# EAGLE board AK4493-v1.64_23 (EAGLE 9.6.2)
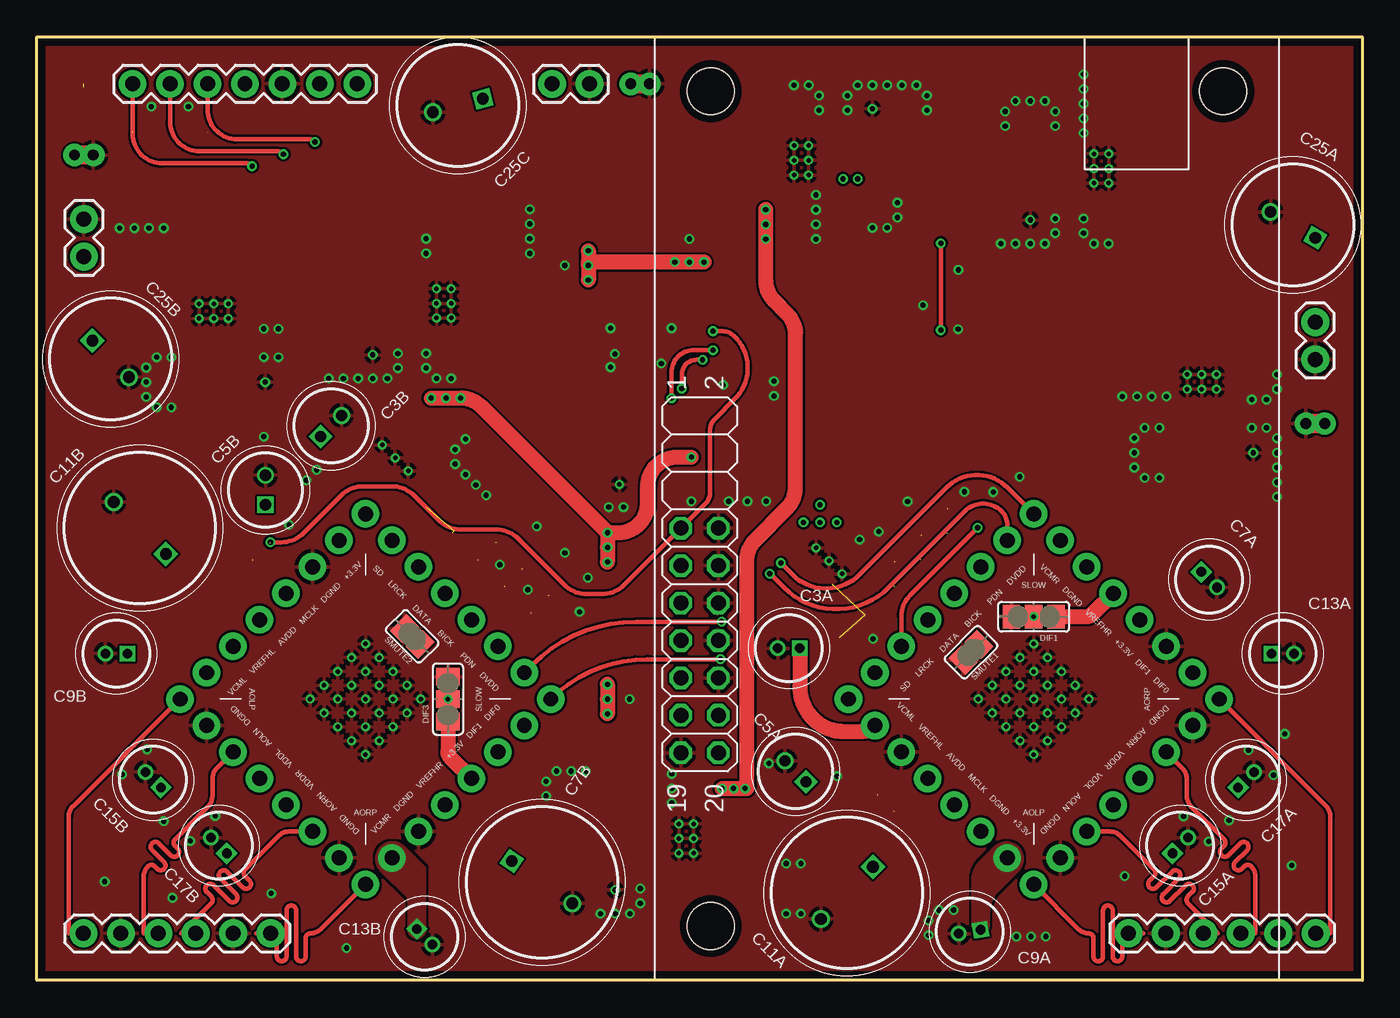
[diagram p2: board, top side]
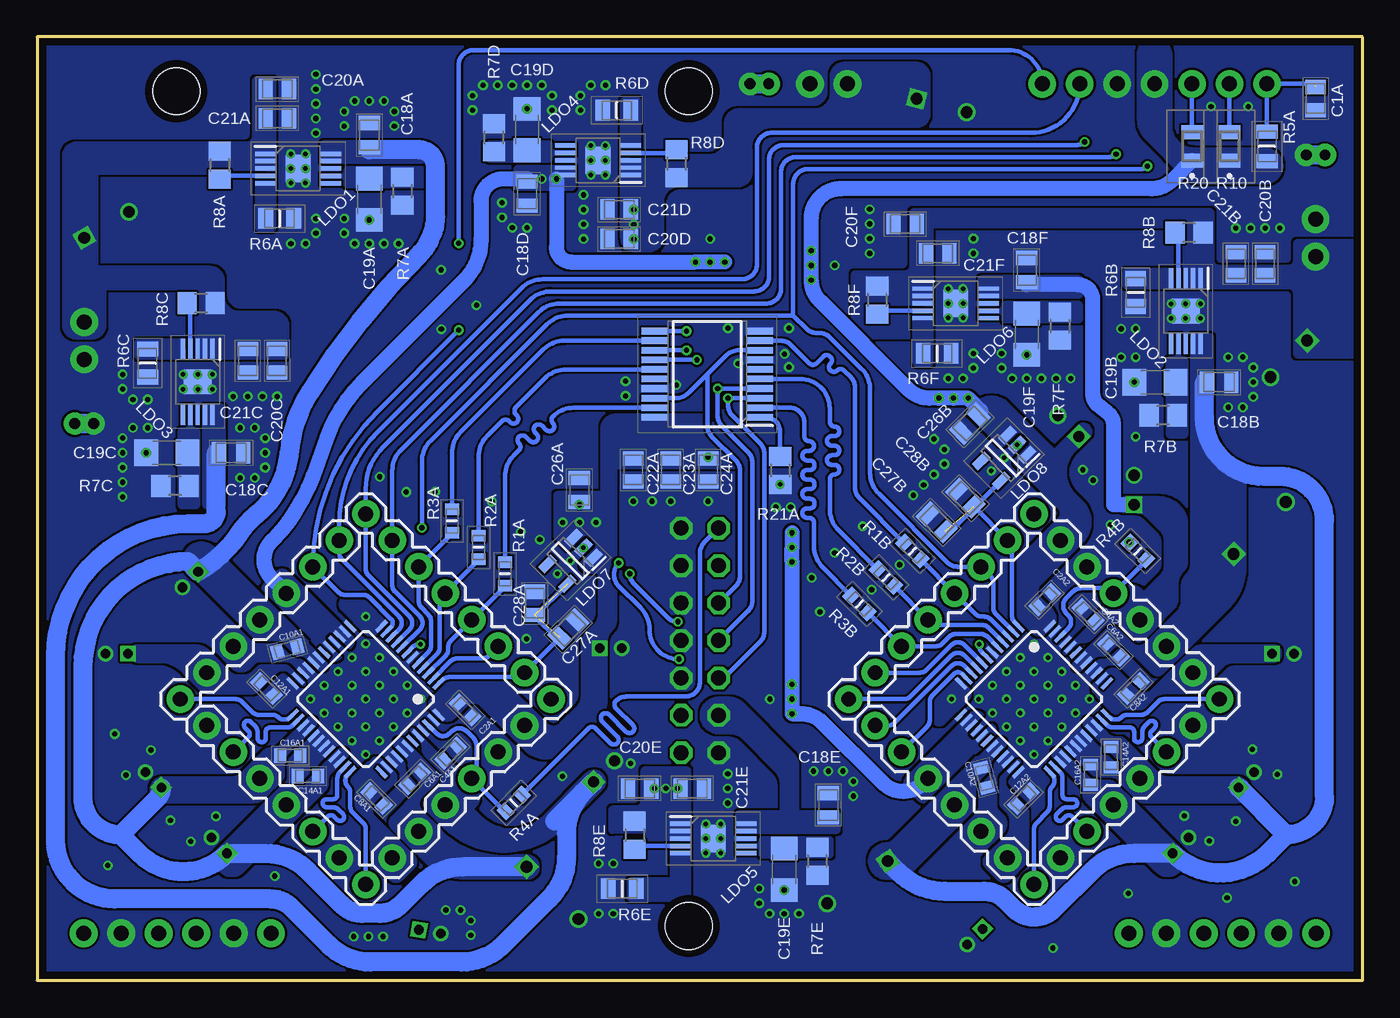
[diagram p3: board, bottom side, seen from below]

Size 89.89 x 64 mm. Coordinates in mm from the lower left corner, seen from the top.
Outline: 0,64 89.89,64 89.89,0 0,0 0,64
Copper layers (1*16): Top 0.035mm / dielectric 1.6mm / Bottom 0.035mm
Design rules "Elecrow_2-layer_PCB_eagle_rule": minimum track width 6mil, minimum drill 12mil, track to track 6mil, track to pad 6mil, pad to pad 6mil, via to via 8mil, smd to smd 0mil, copper to edge 20mil, drill to drill 10mil, minimum pad ring 6mil, minimum via ring 6mil, stop-mask expansion 0mil, vias tented up to drill 100mil, thermal gap 10mil
Net classes: 3 Power: width 1.27 mm, drill 1.27 mm, clearance 0.254 mm

## Footprints (pad centres in the part's own frame; a part is rotated, then mirrored left to right if it is on the bottom)
I2SOVERUSBV3 = drill 1.016 octagon: H3.7 33.322,1.745; H3.8 33.322,4.285; H3.9 35.862,1.745; H3.10 35.862,4.285; H3.11 38.403,1.745; H3.12 38.403,4.285; H3.13 40.943,1.745; H3.14 40.943,4.285; H3.15 43.483,1.745; H3.16 43.483,4.285; H3.17 46.023,1.745; H3.18 46.023,4.285; H3.19 48.562,1.745; H3.20 48.562,4.285 | hole 3.175: 3.688,3.775; 3.688,38.525; 60.312,3.775
CAPC2012X135N = smd 0.96 x 1.39: 1 -0.79,0; 2 0.79,0
CAPC1608X95N = smd 0.81 x 0.99: 1 -0.69,0; 2 0.69,0
CAPPRD150W45D450H600 = drill 0.65 pad 1.05 square: 1 0,0 | drill 0.65 pad 1.05: 2 1.5,0
CAPPRD200W55D500H800 = drill 0.75 pad 1.15 square: 1 0,0 | drill 0.75 pad 1.15: 2 2,0
CAPPRD500W60D1025H2150 = drill 0.8 pad 1.2 square: 1 0,0 | drill 0.8 pad 1.2: 2 5,0
CAPC2013X140N = smd 0.96 x 1.44: 1 -0.82,0; 2 0.82,0
C1206 = smd 1.6 x 1.8: 1 -1.4,0; 2 1.4,0 | drill 0.35: DGND 1.4,0
CAPPRD350W60D825H1300 = drill 0.8 pad 1.2 square: 1 0,0 | drill 0.8 pad 1.2: 2 3.5,0
SJ_2 = smd 1.168 x 1.6: 1 -1.524,0; 2 0,0; 3 1.524,0
LQFP48_ = smd 0.25 x 1: 1 -2.75,-4.25; 2 -2.25,-4.25; 3 -1.75,-4.25; 4 -1.25,-4.25; 5 -0.75,-4.25; 6 -0.25,-4.25; 7 0.25,-4.25; 8 0.75,-4.25; 9 1.25,-4.25; 10 1.75,-4.25; 11 2.25,-4.25; 12 2.75,-4.25; 25 2.75,4.25; 26 2.25,4.25; 27 1.75,4.25; 28 1.25,4.25; 29 0.75,4.25; 30 0.25,4.25; 31 -0.25,4.25; 32 -0.75,4.25; 33 -1.25,4.25; 34 -1.75,4.25; 35 -2.25,4.25; 36 -2.75,4.25 | smd 1 x 0.25: 13 4.25,-2.75; 14 4.25,-2.25; 15 4.25,-1.75; 16 4.25,-1.25; 17 4.25,-0.75; 18 4.25,-0.25; 19 4.25,0.25; 20 4.25,0.75; 21 4.25,1.25; 22 4.25,1.75; 23 4.25,2.25; 24 4.25,2.75; 37 -4.25,2.75; 38 -4.25,2.25; 39 -4.25,1.75; 40 -4.25,1.25; 41 -4.25,0.75; 42 -4.25,0.25; 43 -4.25,-0.25; 44 -4.25,-0.75; 45 -4.25,-1.25; 46 -4.25,-1.75; 47 -4.25,-2.25; 48 -4.25,-2.75 | drill 0.305 pad 0.61: P$1 0,0; P$2 -1.327,0; P$3 -2.655,0; P$4 1.327,0; P$5 2.655,0; P$6 0,1.327; P$7 0,2.655; P$8 0,-1.327; P$9 0,-2.655; P$10 -1.327,-1.327; P$11 -2.655,-1.327; P$12 -2.655,-2.655; P$13 -1.327,-2.655; P$14 1.327,-2.655; P$15 2.655,-2.655; P$16 2.655,-1.327; P$17 1.327,-1.327; P$18 1.327,1.327; P$19 2.655,1.327; P$20 2.655,2.655; P$21 1.327,2.655; P$22 -1.327,2.655; P$23 -2.655,2.655; P$24 -2.655,1.327; P$25 -1.327,1.327
SOP65P780X200-20N = smd 1.8 x 0.45: 1 -3.55,2.925; 2 -3.55,2.275; 3 -3.55,1.625; 4 -3.55,0.975; 5 -3.55,0.325; 6 -3.55,-0.325; 7 -3.55,-0.975; 8 -3.55,-1.625; 9 -3.55,-2.275; 10 -3.55,-2.925; 11 3.55,-2.925; 12 3.55,-2.275; 13 3.55,-1.625; 14 3.55,-0.975; 15 3.55,-0.325; 16 3.55,0.325; 17 3.55,0.975; 18 3.55,1.625; 19 3.55,2.275; 20 3.55,2.925
1X02 = drill 1.016 pad 1.88: 1 0,0; 2 2.54,0
1X07 = drill 1.016 pad 1.88: 1 0,0; 2 2.54,0; 3 5.08,0; 4 7.62,0; 5 10.16,0; 6 12.7,0; 7 15.24,0
1X06 = drill 1.016 pad 1.88: 1 0,0; 2 2.54,0; 3 5.08,0; 4 7.62,0; 5 10.16,0; 6 12.7,0
SOP50P490X110-11N = smd 1.425 x 0.3: 1 -2.212,1; 2 -2.212,0.5; 3 -2.212,0; 4 -2.212,-0.5; 5 -2.212,-1; 6 2.212,-1; 7 2.212,-0.5; 8 2.212,0; 9 2.212,0.5; 10 2.212,1 | smd 1.68 x 1.88: 11 0,0 | drill 0.305 pad 0.61: P$1 -0.498,0; P$2 0.498,0; P$3 -0.498,0.995; P$4 0.498,0.995; P$5 -0.498,-0.995; P$6 0.498,-0.995
SOT95P280X145-5N = smd 1.2 x 0.6: 1 -1.25,0.95; 2 -1.25,0; 3 -1.25,-0.95; 4 1.25,-0.95; 5 1.25,0.95 | drill 0.305 pad 0.61: DGND -1.25,0; DGND2 0,0; DGND3 1.25,0
RESC1608X55N = smd 0.8 x 0.95: 1 -0.8,0; 2 0.8,0
RESC2012X50N = smd 0.95 x 1.45: 1 -1,0; 2 1,0
RESC2012X60N = smd 1 x 1.4: 1 -0.95,0; 2 0.95,0
R0805 = smd 1.3 x 1.5: 1 -0.95,0; 2 0.95,0
RCS0805_E3 = smd 0.95 x 1.45: 1 -0.975,0; 2 0.975,0
R0805-POL = smd 1.3 x 1.5: 1 -0.95,0; 2 0.95,0 | drill 0.305 pad 0.61: DGND 0.95,0
SHORT_ALL-50 = drill 0.737 pad 1.524: 1 -0.635,0; 2 0.635,0
SJ = smd 1.168 x 1.6: 1 -0.762,0; 2 0.762,0

## Placement (x,y rotation side)
BD1  I2SOVERUSBV3  [I2SOVERUSBV3]  41.93,64 270 top
C1A  0.1uF, X7R  [CAPC2012X135N]  3.19,59.81 270 bottom
C2A1  0.1u, Ceramic Capacitor X7R  [CAPC1608X95N]  60.87,18.35 315 bottom
C2A2  0.1u, Ceramic Capacitor X7R  [CAPC1608X95N]  21.55,25.82 45 bottom
C3A  80-A758BG106M1EAAE70  [CAPPRD150W45D450H600]  51.75,22.53 180 top
C3B  80-A758BG106M1EAAE70  [CAPPRD200W55D500H800]  19.25,36.9 45 top
C4A1  0.1u, Ceramic Capacitor X7R  [CAPC1608X95N]  61.86,15.42 45 bottom
C4A2  0.1u, Ceramic Capacitor X7R  [CAPC1608X95N]  18.62,24.83 135 bottom
C5A  80-A758BG106M1EAAE70  [CAPPRD200W55D500H800]  52.15,13.47 135 top
C5B  80-A758BG106M1EAAE70  [CAPPRD200W55D500H800]  15.5,32.26 90 top
C6A1  0.1u, Ceramic Capacitor X7R  [CAPC1608X95N]  64.3,13.68 225 bottom
C6A2  0.1u, Ceramic Capacitor X7R  [CAPC1608X95N]  16.88,22.39 315 bottom
C7A  RNU1A100MDSASQ  [CAPPRD150W45D450H600]  78.97,27.72 315 top
C7B  APSG160ELL222MJ20S  [CAPPRD500W60D1025H2150]  32.22,8.09 325 top
C8A1  0.1u, Ceramic Capacitor X7R  [CAPC1608X95N]  66.88,12.34 315 bottom
C8A2  0.1u, Ceramic Capacitor X7R  [CAPC1608X95N]  15.54,19.81 45 bottom
C9A  647-RNU1A100MDSASQ  [CAPPRD150W45D450H600]  64,3.44 190 top
C9B  647-RNU1A100MDSASQ  [CAPPRD150W45D450H600]  6.14,22.17 180 top
C10A1  0.1u, Ceramic Capacitor X7R  [CAPC1608X95N]  72.93,22.46 195 bottom
C10A2  0.1u, Ceramic Capacitor X7R  [CAPC1608X95N]  25.66,13.75 285 bottom
C11A  APSG160ELL222MJ20S  [CAPPRD500W60D1025H2150]  56.71,7.7 225 top
C11B  2200uF, 10V  [CAPPRD500W60D1025H2150]  8.75,28.92 135 top
C12A1  0.1u, Ceramic Capacitor X7R  [CAPC1608X95N]  74.34,19.8 315 bottom
C12A2  0.1u, Ceramic Capacitor X7R  [CAPC1608X95N]  23.01,12.34 45 bottom
C13A  647-RNU1A100MDSASQ  [CAPPRD150W45D450H600]  83.75,22.17 0 top
C13B  647-RNU1A100MDSASQ  [CAPPRD150W45D450H600]  25.77,3.49 315 top
C14A1  0.1u, Ceramic Capacitor X7R  [CAPC1608X95N]  71.53,13.86 180 bottom
C14A2  0.1u, Ceramic Capacitor X7R  [CAPC1608X95N]  17.06,15.15 270 bottom
C15A  647-RNU1A100MDSASQ  [CAPPRD150W45D450H600]  77.01,8.62 45 top
C15B  647-RNU1A100MDSASQ  [CAPPRD150W45D450H600]  8.41,13.08 135 top
C16A1  0.1u, Ceramic Capacitor X7R  [CAPC1608X95N]  72.74,15.24 0 bottom
C16A2  0.1u, Ceramic Capacitor X7R  [CAPC1608X95N]  18.45,13.95 90 bottom
C17A  647-RNU1A100MDSASQ  [CAPPRD150W45D450H600]  81.48,13.08 45 top
C17B  647-RNU1A100MDSASQ  [CAPPRD150W45D450H600]  12.88,8.62 135 top
C18A  4.7u  [CAPC2013X140N]  67.37,57.34 90 bottom
C18B  4.7u  [CAPC2013X140N]  9.73,40.58 0 bottom
C18C  4.7u  [CAPC2013X140N]  76.74,35.78 0 bottom
C18D  4.7u  [CAPC2013X140N]  56.67,53.36 270 bottom
C18E  4.7u  [CAPC2013X140N]  36.24,11.89 90 bottom
C18F  4.7u  [CAPC2013X140N]  22.78,48.19 90 bottom
C19A  22u  [C1206]  67.37,52.98 270 bottom
C19B  22u  [C1206]  14.08,40.58 180 bottom
C19C  22u  [C1206]  81.1,35.78 180 bottom
C19D  22u  [C1206]  56.67,57.72 90 bottom
C19E  22u  [C1206]  39.22,7.53 270 bottom
C19F  22u  [C1206]  22.78,43.83 270 bottom
C20A  10u  [CAPC2012X135N]  73.61,60.46 0 bottom
C20B  10u  [CAPC2012X135N]  6.61,48.61 90 bottom
C20C  10u  [CAPC2012X135N]  73.62,42.03 270 bottom
C20D  10u  [CAPC2012X135N]  50.43,50.29 180 bottom
C20E  10u  [CAPC2012X135N]  49.03,13.02 180 bottom
C20F  10u  [CAPC2012X135N]  31.02,51.31 180 bottom
C21A  0.1u  [CAPC2012X135N]  73.61,58.47 0 bottom
C21B  0.1u  [CAPC2012X135N]  8.6,48.61 90 bottom
C21C  0.1u  [CAPC2012X135N]  75.61,42.03 270 bottom
C21D  0.1u  [CAPC2012X135N]  50.43,52.28 180 bottom
C21E  0.1u  [CAPC2012X135N]  45.47,13.02 0 bottom
C21F  0.1u  [CAPC2012X135N]  28.81,49.32 0 bottom
C22A  0.1u, Ceramic Capacitor X7R  [CAPC2012X135N]  49.47,34.62 270 bottom
C23A  0.1u, Ceramic Capacitor X7R  [CAPC2012X135N]  46.93,34.62 270 bottom
C24A  0.1u, Ceramic Capacitor X7R  [CAPC2012X135N]  44.39,34.62 270 bottom
C25A  470u  [CAPPRD350W60D825H1300]  86.7,50.37 150 top
C25B  470u  [CAPPRD350W60D825H1300]  3.77,43.39 315 top
C25C  470u  [CAPPRD350W60D825H1300]  30.24,59.8 195 top
C26A  4.7u, Ceramic Capacitor X7R  [CAPC2013X140N]  53.12,33.27 90 bottom
C26B  4.7u, Ceramic Capacitor X7R  [CAPC2013X140N]  26.62,37.76 225 bottom
C27A  4.7u, Ceramic Capacitor X7R  [CAPC2013X140N]  53.87,23.84 45 bottom
C27B  4.7u, Ceramic Capacitor X7R  [CAPC2013X140N]  28.89,31.07 135 bottom
C28A  0.1u, Ceramic Capacitor X7R  [CAPC2012X135N]  56.14,25.57 90 bottom
C28B  0.1u, Ceramic Capacitor X7R  [CAPC2012X135N]  26.93,32.71 135 bottom
DIF1  [SJ_2]  67.61,24.67 0 top
DIF3  [SJ_2]  27.88,19.08 270 top
IC2  AK4493  [LQFP48_]  67.61,19.08 135 bottom
IC3  AK4493  [LQFP48_]  22.28,19.08 225 bottom
IC4A  SN74ABT273DBR  [SOP65P780X200-20N]  44.44,41.12 180 bottom
J1  [1X02]  3.19,49.1 90 top
J2  [1X02]  34.94,60.81 0 top
J3  [1X07]  6.49,60.81 0 top
J4  [1X06]  74.03,3.19 0 top
J5  [1X07]  80.18,19.08 45 bottom
J6  [1X07]  67.61,6.51 135 bottom
J7  [1X07]  55.03,19.08 225 bottom
J8  [1X07]  67.61,31.65 315 bottom
J9  [1X07]  22.28,6.51 135 bottom
J10  [1X07]  9.71,19.08 225 bottom
J11  [1X07]  22.28,31.65 315 bottom
J12  [1X07]  34.85,19.08 45 bottom
J13  [1X06]  3.16,3.19 0 top
J14  [1X02]  86.7,44.66 270 top
LDO1  LT3042  [SOP50P490X110-11N]  72.19,55.07 0 bottom
LDO2  LT3042  [SOP50P490X110-11N]  11.99,45.4 270 bottom
LDO3  LT3042  [SOP50P490X110-11N]  79.01,40.6 270 bottom
LDO4  LT3042  [SOP50P490X110-11N]  51.85,55.63 180 bottom
LDO5  LT3042  [SOP50P490X110-11N]  44.04,9.62 0 bottom
LDO6  LT3042  [SOP50P490X110-11N]  27.6,45.92 0 bottom
LDO7  LP5907-1.8V  [SOT95P280X145-5N]  53.72,28.46 225 bottom
LDO8  LP5907-1.8V  [SOT95P280X145-5N]  24.31,35.44 225 bottom
R1A  RT0603DRE075R1L  [RESC1608X55N]  58.17,27.57 270 bottom
R1B  RT0603DRE075R1L  [RESC1608X55N]  30.53,29.12 315 bottom
R2A  RT0603DRE075R1L  [RESC1608X55N]  59.96,29.37 270 bottom
R2B  RT0603DRE075R1L  [RESC1608X55N]  32.32,27.32 315 bottom
R3A  RT0603DRE075R1L  [RESC1608X55N]  61.76,31.16 270 bottom
R3B  RT0603DRE075R1L  [RESC1608X55N]  34.12,25.53 315 bottom
R4A  RT0603DRE075R1L  [RESC1608X55N]  57.57,12.04 225 bottom
R4B  RT0603DRE075R1L  [RESC1608X55N]  15.24,29.12 315 bottom
R5A  10K, Resistor 1%  [RESC2012X50N]  6.49,56.57 270 bottom
R6A  1k  [RESC2012X60N]  73.45,51.68 0 bottom
R6B  1k  [RESC2012X60N]  15.39,46.66 270 bottom
R6C  1k  [RESC2012X60N]  82.4,41.87 270 bottom
R6D  1k  [RESC2012X60N]  50.59,59.02 180 bottom
R6E  1k  [RESC2012X60N]  50.21,6.23 180 bottom
R6F  1k  [RESC2012X60N]  28.86,42.53 0 bottom
R7A  33k  [R0805]  65.13,53.53 270 bottom
R7B  33k  [R0805]  13.53,38.33 180 bottom
R7C  33k  [R0805]  80.55,33.54 180 bottom
R7D  33k  [R0805]  58.91,57.17 90 bottom
R7E  33k  [R0805]  36.98,8.08 270 bottom
R7F  33k  [R0805]  20.54,44.38 270 bottom
R8A  200k  [R0805]  77.51,55.3 270 bottom
R8B  200k  [R0805]  11.77,50.72 180 bottom
R8C  200k  [R0805]  78.78,45.93 180 bottom
R8D  200k  [R0805]  46.52,55.4 90 bottom
R8E  200k  [R0805]  49.37,9.85 270 bottom
R8F  200k  [R0805]  32.92,46.15 270 bottom
R10  2.2k, 1%  [RCS0805_E3]  9.03,56.57 90 bottom
R20  2.2k, 1%  [RCS0805_E3]  11.57,56.57 90 bottom
R21A  Not Pop.  [R0805-POL]  39.5,34.59 270 bottom
SH1  SHORTA5  [SHORT_ALL-50]  3.19,55.99 180 top
SH2  SHORTA5  [SHORT_ALL-50]  40.91,60.81 180 top
SH3  SHORTA5  [SHORT_ALL-50]  86.7,37.77 0 top
SMUTE1  [SJ]  63.35,22.26 225 top
SMUTE2  [SJ]  25.46,23.33 135 top

## Tracks (layer width: path | path; a pad name or v marks a point on that pad's centre or on a via)
+3V3  (via drill 0.35)
  Top 1.016: 71.58,24.85 arc-45 71.15,24.67 DIF1.3 | 28.05,15.1 arc-45 27.88,15.53 DIF3.3 | J7.2 arc-45 55.86,16.88 54.75,16.88 arc-90 51.75,19.88 C3A.1 | v38.7,28.38 v38.7,29.37 v38.7,30.37 | v38.7,20.08 v38.7,19.08 v38.7,18.09 | v38.7,30.37 30.15,38.91 arc45 v28.74,39.5 v27.74,39.5 v26.75,39.5 | v37.4,49.5 v37.4,48.5 | v37.4,48.5 v37.4,47.51 | v45.25,48.73 v44.25,48.73 v43.26,48.73 37.4,48.73 v37.4,48.5 | v44.39,35.49 43.43,35.49 arc90 41.43,33.49 41.43,32.37 arc-90 39.43,30.37 v38.7,30.37
  Top 1.06: J5.5 71.58,24.85 | J9.5 28.05,15.1
  Bottom 1.016: v54.68,54.36 54.68,49.73 arc-90 53.68,48.73 v45.25,48.73 v44.25,48.73 v43.26,48.73 | J5.5 73.99,27.26 arc90 73.99,29.81 arc-25 71.19,34.22 70.26,36.8 arc25 67.92,40.48 60.97,47.43 arc-45 59.8,50.26 59.8,52.86 arc90 58.3,54.36 56.67,54.36 | 11.57,55.62 12.9,54.29 arc45 14.32,53.7 35.4,53.7 arc-90 37.4,51.7 v37.4,49.5 v37.4,48.5 v37.4,47.51 arc-45 36.81,46.09 30.81,40.09 arc-45 29.39,39.5 v28.74,39.5 v27.74,39.5 v26.75,39.5 25.92,38.67 25.92,38.47 | J9.5 29.74,13.42 arc90 32.57,13.42 36.65,17.5 arc-45 38.07,18.09 v38.7,18.09 v38.7,19.08 v38.7,20.08 v38.7,28.38 v38.7,29.37 v38.7,30.37
  other vias: 55.67,54.36 54.25,31.07 53.12,32.27 53.12,31.07 51.99,31.07
  pour Bottom (no thermals): 57.59,53.89 57.59,54.98 arc90 57.27,55.31 53.67,55.31 arc90 53.35,54.98 53.35,53.89 arc90 53.67,53.56 57.27,53.56 arc90
  pour Bottom (no thermals): 5.39,55.24 arc90 6.64,53.99 10.87,53.99 arc45 12.28,54.58 14.72,57.02 arc45 15.3,58.43 15.3,62.86 arc90 14.17,64 arc90 12.92,62.75 12.92,57.99 arc-90 11.42,56.49 6.64,56.49 arc90
  pour Bottom (no thermals): 21.82,26.84 18.97,29.68 arc-90 18.97,30.54 19.8,31.37 arc-90 20.66,31.37 23.6,28.43 arc-45 23.82,27.88 23.82,25.22 arc-45 23.64,24.79 22.36,23.51 arc-90 21.5,23.51 20.99,24.01 arc-90 20.99,25.15 21.82,25.97 arc90
  pour Bottom (no thermals): 56.14,15.77 55.32,16.59 arc-90 55.32,17.46 58.25,20.39 arc-45 58.8,20.62 61.46,20.62 arc-45 61.89,20.44 63.18,19.16 arc-90 63.18,18.29 62.67,17.78 arc-90 61.54,17.78 60.71,18.61 arc90 59.85,18.61 57,15.77 arc-90
  pour Bottom (rank 2, no thermals): 29.29,12.18 24.99,16.48 arc-90 24.99,17.34 25.79,18.14 arc-90 26.65,18.14 30.95,13.84 arc-90 30.95,12.97 30.15,12.18 arc-90
  pour Bottom (rank 2, no thermals): 74.51,26.09 70.21,21.79 arc-90 69.35,21.79 68.55,22.58 arc-90 68.55,23.45 72.85,27.75 arc-90 73.71,27.75 74.51,26.95 arc-90
  pour Bottom (no thermals): 42.34,35.02 42.34,35.84 arc-45 42.44,36.07 44.72,38.35 arc-45 44.95,38.44 50.57,38.44 50.57,34.7 42.67,34.7 arc-90
  pour Bottom (no thermals): 53,27.94 52.77,27.71 arc-45 52.54,27.61 51.67,27.61 arc-90 51.35,27.94 51.35,32.87 arc-90 51.67,33.19 54.56,33.19 arc-90 54.89,32.87 54.89,30.19 arc-45 54.79,29.96 54.01,29.18 arc-90 53.78,29.18 52.89,30.07 arc90 52.43,30.07 52.11,29.75 arc90 52.11,29.29 53,28.4 arc-90
  pour Bottom (no thermals): 23.59,34.92 23.48,34.82 arc-90 23.02,34.82 21.58,36.27 arc-90 21.58,36.73 24.05,39.2 arc-90 26.31,39.2 26.74,38.77 arc-90 26.74,38.31 24.71,36.28 arc-90 24.25,36.28 23.48,37.05 arc90 23.02,37.05 22.7,36.73 arc90 22.7,36.27 23.59,35.38 arc-90
  pour Bottom (no thermals): 20.91,36.06 19.28,37.69 arc45 18.96,37.83 arc90 18.33,37.2 arc45 18.47,36.88 19.48,35.87 arc-90 19.48,33.04 18.97,32.53 arc90 18.97,29.68 20.66,31.37 arc-90 20.66,32 23.48,34.82 21.58,36.73
  pour Bottom (no thermals): 50.57,38.44 50.57,27.61 51.67,27.61 51.67,37.44 arc90 50.67,38.44
  pour Bottom (no thermals): 50.57,27.61 50.57,24.44 arc45 50.86,23.73 50.92,23.68 arc-45 51.22,22.97 51.22,21.66 arc90 52.21,20.66 arc90 53.02,21.46 53.02,22.88 arc45 52.72,23.58 52.14,24.16 arc-45 51.85,24.87 51.85,27.61
  pour Bottom (no thermals): 51.22,21.66 51.22,19.05 arc47 51.84,17.6 54.03,15.54 arc88 56.81,15.58 57,15.77 55.32,17.46 arc-90 54.45,17.46 53.31,18.6 arc-45 53.02,19.31 53.02,21.66
+5V/1
  Bottom 1.272: 67.37,56.34 63.99,56.34 arc90 62.89,55.24 62.89,51.96 arc45 64.06,49.13 arc-13 71.41,39.89 arc-26 72.81,35.75 arc45 75.04,31.57 arc-17 76.2,30.3 arc26 C7A.1 79.66,28.4 arc-90 86.8,21.26 86.8,12.46 arc-90 84.22,9.88 | 81.48,13.04 arc45 81.77,12.33 84.22,9.88 | 84.22,9.88 82.96,8.62 arc-90 C15A.1 | C15A.1 | C15A.1 74.38,8.62 arc45 71.55,7.45 69.24,5.14 arc-45 67.82,4.55 66.65,4.55 arc-45 65.23,5.14 63.84,6.53 arc45 61.01,7.7 C11A.1
  pour Bottom (no thermals): 63.87,55.39 70.36,55.39 arc90 70.69,55.72 70.69,56.66 arc90 70.36,56.98 63.87,56.98 arc90 63.55,56.66 63.55,55.72 arc90
  pour Bottom (no thermals): 63.77,11.54 62.5,10.27 arc90 62.5,9.41 63.33,8.58 arc90 64.19,8.58 65.87,10.26 arc90 65.87,11.12 64.18,12.81 arc-90 64.18,13.67 64.54,14.03 arc45 64.72,14.46 64.72,14.63 arc-45 64.9,15.06 65.6,15.77 arc180 65.01,16.37 62.84,14.2 arc90 62.84,13.34 63.77,12.4 arc-90
  pour Bottom (no thermals): 70.32,21.68 71.41,22.77 arc45 71.48,22.95 arc-45 71.54,23.09 74.52,26.07 arc-90 75.39,26.07 76.3,25.15 arc-90 76.3,24.29 75.22,23.21 arc-45 74.79,23.03 73.65,23.03 arc45 73.22,22.85 72.53,22.16 arc-45 72.1,21.98 72.07,21.98 arc45 71.64,21.81 70.91,21.08 arc-180
  pour Bottom (no thermals): 68.9,15.06 arc-180 69.5,15.66 71.75,13.41 arc45 72.18,13.23 73.09,13.23 arc-45 73.52,13.05 74.51,12.07 arc-90 74.51,11.21 73.68,10.38 arc-90 72.82,10.38 70.3,12.9 arc-45 70.12,13.33 70.12,13.59 arc45 69.95,14.02
  pour Bottom (no thermals): 71.62,17.78 arc180 71.02,17.18 72.91,15.29 arc-45 73.09,14.86 73.09,13.95 arc45 73.27,13.52 73.79,13 arc90 76.3,13 arc90 76.3,13.86 74.56,15.61 arc45 74.13,15.79 73.87,15.79 arc-45 73.44,15.97
  pour Bottom (no thermals): 76.3,24.29 79.64,27.62 arc90 79.64,29.41 arc90 77.86,29.41 74.52,26.07
  pour Bottom (rank 2, no thermals): 62.5,10.27 arc-45 58,8.54 56.66,8.54 arc90 55.81,7.69 arc90 56.66,6.84 60.93,6.84 arc45 63.52,7.91 64.19,8.58
  pour Bottom (no thermals): 72.82,10.38 75.84,7.36 arc90 77.53,7.36 77.74,7.57 arc90 77.74,8.84 74.51,12.07
  pour Bottom (no thermals): 74.12,14.36 arc90 74.12,12.66 74.47,12.32 arc45 75.18,12.03 81.36,12.03 arc90 82.27,12.93 arc90 81.36,13.83 76.76,13.83 arc-45 76.05,14.12 75.81,14.35 arc90
+5V/2
  Bottom 1.272: 5.17,9.88 arc-90 2.59,12.46 2.59,31.19 arc-90 5.59,34.19 6.73,34.19 arc90 10.73,38.19 10.73,40.58 | C7B.1 31.47,7.34 arc-45 28.35,6.05 25.67,6.05 arc45 24.25,5.46 23.67,4.89 arc-45 22.26,4.3 arc-45 20.94,4.85 18.34,7.45 arc45 15.51,8.62 C17B.1 arc-90 6.43,8.62 5.17,9.88 | C15B.1 5.21,9.88 5.17,9.88
  pour Bottom (no thermals): 11.68,37.08 11.68,43.57 arc90 11.35,43.9 10.41,43.9 arc90 10.08,43.57 10.08,37.08 arc90 10.41,36.75 11.35,36.75 arc90
  pour Bottom (no thermals): 24.88,16.37 25.98,15.28 arc45 26.15,15.2 arc-45 26.29,15.14 29.28,12.16 arc-90 29.28,11.3 28.36,10.38 arc-90 27.5,10.38 26.41,11.46 arc-45 26.24,11.89 26.24,13.04 arc45 26.06,13.47 25.37,14.16 arc-45 25.19,14.59 25.19,14.61 arc45 25.01,15.04 24.28,15.77 arc-180
  pour Bottom (no thermals): 14.75,22.91 13.48,24.18 arc90 12.61,24.18 11.79,23.36 arc90 11.79,22.5 13.47,20.82 arc90 14.33,20.82 16.01,22.5 arc-90 16.88,22.5 17.23,22.14 arc45 17.67,21.97 17.84,21.97 arc-45 18.27,21.79 18.97,21.08 arc180 19.57,21.68 17.4,23.85 arc90 16.54,23.85 15.61,22.91 arc-90
  pour Bottom (no thermals): 20.99,15.06 arc180 20.39,15.66 18.5,13.77 arc-45 18.06,13.59 17.16,13.59 arc45 16.72,13.41 15.38,12.07 arc90 15.38,11.21 16.21,10.38 arc90 17.07,10.38 18.82,12.13 arc45 18.99,12.56 18.99,12.82 arc-45 19.17,13.25
  pour Bottom (no thermals): 18.27,17.78 arc-180 18.87,17.18 16.61,14.93 arc45 16.43,14.5 16.43,13.59 arc-45 16.26,13.16 15.27,12.18 arc-90 14.41,12.18 13.58,13 arc-90 13.58,13.86 16.1,16.38 arc-45 16.53,16.56 16.79,16.56 arc45 17.22,16.74
  pour Bottom (no thermals): 7.88,34.19 7.88,28.06 arc45 9.06,25.23 11.79,22.5 13.48,24.18 12.62,25.04 arc-45 12.33,25.74 12.33,26.71 arc45 11.96,27.61 arc-45 11.68,28.29 11.68,37.08 10.73,37.08 10.73,37.03 arc-90
  pour Bottom (no thermals): 27.5,10.38 30.47,7.41 arc45 31.88,6.82 32.27,6.82 arc90 33.54,8.09 arc90 32.27,9.37 arc-45 31.92,9.51 29.27,12.16
  pour Bottom (no thermals): 15.76,14.36 arc-90 14.07,14.35 arc-90
  pour Bottom (no thermals): 15.76,14.36 arc-90 15.77,12.66 15.42,12.32 arc-45 14.71,12.03 8.52,12.03 arc-90 7.62,12.93 arc-90 8.52,13.83 13.13,13.83 arc45 13.84,14.12 14.07,14.35 arc-90
  pour Bottom (no thermals): 17.07,10.38 14.05,7.36 arc-90 12.36,7.36 12.15,7.57 arc-90 12.15,8.84 15.38,12.07
+5V/3
  pour Bottom (no thermals): 35.73,9.94 42.22,9.94 arc90 42.54,10.27 42.54,11.21 arc90 42.22,11.53 35.73,11.53 arc90 35.4,11.21 35.4,10.27 arc90
  pour Bottom (no thermals): 38.22,11.53 38.22,14.54 arc-45 38.59,15.44 42.03,18.88 arc-45 42.93,19.25 43.67,19.25 arc-90 44.94,17.98 arc-90 43.67,16.71 42.93,16.71 arc45 42.03,16.34 39.89,14.19 arc45 39.52,13.29 39.52,11.53
BCLK
  Bottom 0.305: IC4A.18 46.59,39.49 arc-45 45.7,39.87 44.44,41.12 | IC4A.8 42.29,42.74 arc-45 43.19,42.37 44.44,41.12 | BD1.H3.11 42.51,26.77 arc-45 42.21,27.47 42.21,34.55 arc-45 42.51,35.26 44.15,36.91 arc45 44.44,37.61 44.44,41.12
DATA  (via drill 0.35)
  Top 0.305: v45.15,42.09 44.74,42.09 arc90 43.74,41.09 v43.74,40.15
  Bottom 0.305: IC4A.14 v45.15,42.09 | IC4A.4 v43.74,40.15 43.74,38.32 arc-45 43.45,37.61 41.69,35.85 arc45 41.39,35.14 41.39,25.75 arc45 41.69,25.05 BD1.H3.13
DGND  (via drill 0.35)
  other vias: 52.84,53.28 52.84,52.28 53.05,59.02 53.05,60.02 52.35,60.72 51.35,60.72 34.54,12.5 34.54,13.49 35.24,14.2 36.24,14.2 43.05,12.02 43.05,13.02 43.05,14.01 65.67,57.95 65.67,58.94 66.37,59.65 67.37,59.65 68.36,59.65 69.07,58.94 69.07,57.95 70.99,57.47 70.99,58.47 70.99,59.46 70.99,60.46 70.99,61.46 26.4,49.32 26.4,50.31 76.13,34.09 75.14,34.09 74.43,34.79 74.43,35.78 74.43,36.78 75.14,37.48 76.13,37.48 76.6,39.61 75.61,39.61 74.61,39.61 73.62,39.61 9.12,38.88 8.12,38.88 7.42,39.58 7.42,40.58 7.42,41.57 8.12,42.27 9.12,42.27 8.6,51.02 7.6,51.02 6.61,51.02 5.61,51.02 44.39,32.5 46.93,32.5 48.2,32.5 49.47,32.5 46.54,40.39 42.35,41.85 39.2,42.49 38.9,41.6 52.84,51.29 52.84,50.29 37.23,14.2 54.97,59.02 54.97,60.02 55.67,60.72 56.67,60.72 57.66,60.72 58.66,60.72 59.65,60.72 60.36,60.02 60.36,59.02 38.9,44.25 43.04,44.25 49.99,40.64 49.99,39.65 15.39,44.19 16.38,44.19 15.39,42.27 16.38,42.27 15.39,36.89 26.4,42.53 26.4,41.53 27.1,40.83 28.1,40.83 24.48,42.53 24.48,41.53 23.77,40.83 22.78,40.83 21.78,40.83 20.79,40.83 19.79,40.83 29.07,36.72 28.36,36.02 28.36,35.02 29.07,34.32 29.77,33.61 30.48,32.91 58.37,52.75 58.37,51.76 57.66,51.05 56.67,51.05 40.92,6.23 40.92,5.23 40.22,4.53 39.22,4.53 38.23,4.53 82.4,39.4 83.4,39.4 84.1,40.11 84.1,41.1 82.4,37.48 83.4,37.48 84.1,36.78 84.1,35.78 84.1,34.79 84.1,33.79 84.1,32.8 70.99,51.68 70.99,50.68 71.69,49.98 72.69,49.98 69.07,51.68 69.07,50.68 68.36,49.98 67.37,49.98 66.37,49.98 65.38,49.98 49.64,14.72 50.82,7.93 51.81,7.93 51.81,4.53 50.82,4.53 33.43,49.32 33.43,50.31 33.43,51.31 33.43,52.3 39.78,32.1 38.79,32.1 68.42,2.98 67.42,2.98 66.43,2.98 60.48,3.07 60.48,4.07 61.18,4.77 62.18,4.77 77.77,11.12 79.47,9.42 5.78,13.97 7.48,15.67 10.4,9.46 12.1,11.16 82.17,15.62 83.87,13.92 18.98,34.63 18.27,33.93 17.1,30.9 33.9,30.8 35.8,29 37.36,27.31 36.8,25 33.3,26.5 31.4,28.2 54.27,13.85 57.1,30.44 59.06,32.48 62.9,33.15 64.86,33.13 66.66,34.16 10.28,59.27 7.76,59.27 85.1,7.8 84.63,16.72 73.78,7.08 80.85,10.86 21,2.2 15.9,5.9 9.2,5.6 4.6,6.7 8.6,10.8 40.2,19.08 44.25,50.3 35.8,48.5 62.48,44.17 62.5,48.2 60.1,45.8 55.8,29.9 56.71,23.17
  pour Top (rank 6): 0,0 0,64 89.89,64 89.89,0
  pour Bottom (rank 6, no thermals): 0,0 0,64 89.89,64 89.89,0
  pour Bottom (rank 6, no thermals): 53.26,18.65 67.18,4.73 arc90 68.04,4.73 81.95,18.65 arc90 81.95,19.51 68.04,33.42 arc90 67.18,33.42 53.26,19.51 arc90
  pour Top (rank 2): 52.11,19.08 67.61,3.59 83.1,19.08 67.61,34.57
  pour Bottom (no thermals): 68.62,22.1 69.96,23.45 70.21,23.2 68.86,21.86
  pour Bottom (rank 6, no thermals): 21.85,33.42 7.94,19.51 arc90 7.94,18.65 21.85,4.73 arc90 22.71,4.73 36.63,18.65 arc90 36.63,19.51 22.71,33.42 arc90
  pour Top (rank 2): 22.28,34.57 6.79,19.08 22.28,3.59 37.77,19.08
  pour Bottom (no thermals): 25.31,18.07 26.65,16.72 26.41,16.48 25.06,17.82
DIF0
  Bottom 0.305: IC2.10 65.35,23.81 arc-90 65.35,24.67 69.22,28.55 arc45 69.4,28.98 J5.7 69.4,30.88 arc45 66.77,37.24 57.04,46.97 arc45 55.62,47.56 42.08,47.56 arc-90 41.08,48.56 41.08,56.49 arc90 40.08,57.49 22.51,57.49 arc-90 J3.6
DIF1  (via drill 0.35)
  Top 0.305: v61.3,50 v61.3,44.11
  Bottom 0.305: IC2.11 65.88,23.99 arc-90 65.88,24.5 67.36,25.98 arc-45 67.79,26.16 69.04,26.16 arc45 69.47,26.34 J5.6 arc45 66.85,38.56 v61.3,44.11 | v61.3,50 61.3,62.1 arc90 60.3,63.1 24.02,63.1 arc90 J3.7
LRCK  (via drill 0.35)
  Top 0.305: v43.04,39.49 43.04,41.24 arc-90 44.54,42.74 v45.85,42.74
  Bottom 0.305: IC4A.13 v45.85,42.74 | IC4A.3 v43.04,39.49 43.04,39.02 arc-45 42.74,38.31 40.87,36.44 arc45 40.57,35.73 40.57,23.67 arc45 40.87,22.96 43.31,20.52 BD1.H3.15
MCLK  (via drill 0.35)  (2 unrouted)
  Top 0.305: v15.84,29.72 16.57,29.72 arc45 18.09,30.35 20.63,32.89 arc-45 22.15,33.52 24.05,33.52 arc-45 25.57,32.89 27.24,31.22 arc45 28.76,30.59 31.14,30.59 arc-45 32.63,29.97 35.77,26.83 arc45 37.29,26.2 38.31,26.2 arc45 39.83,26.83 BD1.H3.7 45.36,32.37 arc45 45.66,33.07 45.66,37.34 arc-45 45.95,38.05 47.33,39.43 arc90 47.33,43.67 arc45 46.43,44.05 v45.85,44.05
  Bottom 0.305: 56.97,12.64 52.49,17.11 arc90 52.03,17.11 51.01,16.09 arc-90 50.55,16.09 arc-90 50.55,16.55 51.57,17.57 arc90 51.57,18.03 arc90 51.11,18.03 49.95,16.87 arc-90 49.49,16.87 arc-90 49.49,17.32 50.65,18.49 arc90 50.65,18.95 50.65,18.95 arc45 49.94,19.25 45.94,19.25 arc-90 44.94,20.25 44.94,28.99 arc45 44.65,29.7 BD1.H3.7 | v45.85,44.05 IC4A.11
N$1
  Bottom 0.305: R21A.1 39.5,37.2 arc-90 40.5,38.2 IC4A.1
N$2
  pour Bottom (no thermals): 14.35,19.72 11.68,22.39 arc90 10.82,22.39 9.99,21.56 arc90 9.99,20.7 11.44,19.26 arc45 11.87,19.08 13.47,19.08 arc-45 13.9,18.9 14.6,18.2 arc45 15.03,18.02 16.62,18.02 arc45 17.05,18.2 18.21,19.35 arc90 18.21,20.22 17.39,21.03 arc90 16.53,21.03 15.21,19.72 arc-90
  pour Bottom (no thermals): 11.68,22.39 9.99,20.7 9.45,21.24 arc45 8.75,21.53 6.1,21.53 arc-90 5.47,22.17 arc-90 6.1,22.8 10.85,22.8 arc-45 11.56,22.51
N$4
  Bottom 1.272: 77.74,35.78 77.74,31.8 arc90 78.56,30.98 79.64,30.98 arc-90 88.64,21.98 88.64,9.52 arc-90 84.64,5.52 74.05,5.52 arc45 72.63,4.93 70.12,2.42 arc-45 67.29,1.25 61.11,1.25 arc-45 58.28,2.42 55.17,5.53 arc-45 54,8.36 54,9.96 arc45 52.83,12.79 C5A.1 54.8,10.82
  pour Bottom (no thermals): 61.53,10.38 60.13,11.78 arc-90 60.13,13.19 62.29,15.35 arc-45 62.5,15.44 62.54,15.44 arc45 62.76,15.53 64.3,17.08 arc-180 64.54,16.83 64.09,16.37 arc45 63.79,15.67 arc-45 63.59,15.17 62.62,14.2 arc90 62.62,13.34 63.55,12.4 arc-90 63.55,11.54 62.39,10.38 arc-90
  pour Bottom (no thermals): 78.69,32.29 78.69,38.78 arc90 78.36,39.1 77.42,39.1 arc90 77.1,38.78 77.1,32.29 arc90 77.42,31.96 78.36,31.96 arc90
  pour Bottom (no thermals): 51.55,12.93 54.1,10.38 arc90 62.39,10.38 60.7,12.07 59.78,11.17 arc-89 55.56,11.19 52.69,14.06 arc90 51.55,14.06 arc90
N$5
  pour Bottom (no thermals): 82.98,43.53 79.91,43.53 arc90 79.58,43.2 79.58,42.43 arc90 79.91,42.1 82.98,42.1 arc90 83.31,42.43 83.31,43.2 arc90
N$6
  pour Bottom (no thermals): 48.92,59.61 48.92,56.53 arc90 49.25,56.2 50.02,56.2 arc90 50.35,56.53 50.35,59.61 arc90 50.02,59.93 49.25,59.93 arc90
N$7
  pour Bottom (no thermals): 55.25,55.46 59.13,55.46 arc90 59.46,55.79 59.46,56.65 arc90 59.13,56.97 55.25,56.97 arc90 54.92,56.65 arc-90 54.74,56.46 53.35,56.46 53.35,55.98 54.74,55.98 arc-90 54.92,55.79 arc90
N$8
  Bottom 0.305: LDO4.4 46.74,56.13 R8D.2
N$9
  pour Bottom (no thermals): 46.97,6.98 46.97,8.72 arc90 46.64,9.05 45.87,9.05 arc90 45.54,8.72 45.54,5.64 arc90 45.87,5.32 49.58,5.32 arc90 49.9,5.64 49.9,6.66 arc90 49.58,6.98
N$10
  pour Bottom (no thermals): 40.64,9.79 36.21,9.79 arc90 35.88,9.46 35.88,8.6 arc90 36.21,8.28 40.64,8.28 arc90 40.97,8.6 arc-90 41.16,8.79 42.54,8.79 42.54,9.27 41.16,9.27 arc-90 40.97,9.46 arc90
N$11  (1 unrouted)
  Bottom 0.305: 14.64,28.52 J11.4 16.95,26.32 arc-45 17.66,26.61 19.01,26.61 arc-45 19.72,26.32 20.09,25.95 arc-90 20.09,24.89 19.95,24.75 arc90 19.95,23.89 IC3.46
N$13
  Bottom 0.305: LDO5.4 49.15,9.12 R8E.2
N$14  (via drill 0.35)
  Top 1.016: v49.43,52.28 v49.43,51.29 v49.43,50.29 49.43,47.5 arc45 50.01,46.09 50.85,45.25 arc-45 51.44,43.83 51.44,33.42 arc-45 50.85,32 48.74,29.89 arc45 48.15,28.47 48.15,13.02 v48.03,13.02 v47.25,13.02 v46.47,13.02
  pour Bottom (no thermals): 45.54,9.2 48.6,9.2 48.6,9.93 50.82,9.93 arc90 51.15,10.25 51.15,11.53 arc90 50.82,11.86 49.28,11.86 arc-90 48.96,12.18 48.96,14.19 arc90 48.63,14.51 45.87,14.51 arc90 45.54,14.19
  pour Bottom (no thermals): 50.35,50.39 50.35,55.72 arc90 50.02,56.05 45.02,56.05 45.02,53.8 46.39,53.8 arc-90 47.39,52.8 47.39,50.39 arc90 48.39,49.39 49.35,49.39 arc90
  pour Bottom (no thermals): 35.13,62.31 30.31,62.31 arc90 29.31,61.31 29.31,58.79 arc90 30.31,57.79 39.39,57.79 arc-90 41.39,55.79 41.39,54.8 arc90 42.39,53.8 45.2,53.8 45.2,56.05 44.3,56.05 arc-90 43.3,57.05 43.3,58.16 arc90 42.3,59.16 37.13,59.16 arc-90 36.13,60.16 36.13,61.31 arc90
N$15
  pour Bottom (no thermals): 74.79,54.5 74.01,54.5 arc90 73.69,54.17 73.69,51.09 arc90 74.01,50.77 74.79,50.77 arc90 75.11,51.09 75.11,54.17 arc90
N$19  (1 unrouted)
  Bottom 0.305: IC2.5 63.37,22.26 arc-45 63.19,22.69 63.19,24.38 arc-45 63.37,24.81 63.84,25.29 arc45 64.01,25.72 J8.3 61.76,30.31
N$20  (1 unrouted)
  Bottom 0.305: IC2.4 62.76,22.15 arc-45 62.59,22.58 62.59,25.64 arc45 62.41,26.07 J8.4 59.96,28.52
N$21  (1 unrouted)
  Bottom 0.305: IC2.3 62.19,22.02 arc-45 62.01,22.45 62.01,22.62 arc45 61.84,23.05 J8.5 58.17,26.72
N$22
  pour Bottom (no thermals): 68.79,55.24 63.87,55.24 arc90 63.55,54.91 63.55,54.05 arc90 63.87,53.73 68.79,53.73 arc90 69.11,54.05 arc-90 69.3,54.24 70.69,54.24 70.69,54.72 69.3,54.72 arc-90 69.11,54.91 arc90
N$23  (1 unrouted)
  Bottom 0.305: IC4A.19 53.5,38.84 arc-45 54.91,38.26 arc-90 54.91,37.8 arc90 54.91,37.34 arc90 55.37,37.34 55.66,37.63 arc-90 56.12,37.63 arc-90 56.12,37.17 56.01,37.05 arc90 56.01,36.59 arc90 56.47,36.59 56.75,36.88 arc-90 57.21,36.88 arc-90 57.21,36.42 arc90 57.21,35.96 57.58,35.59 | 57.58,35.59 arc-45 58.17,34.18 58.17,28.42 | 57.58,35.59
N$24  (1 unrouted)
  Bottom 0.305: IC4A.15 54.02,41.45 arc-45 55.43,40.86 57.43,38.86 arc-90 57.43,38.4 57.35,38.32 arc90 57.35,37.86 arc90 57.81,37.86 57.89,37.94 arc-90 58.35,37.94 59.38,36.92 arc-45 59.96,35.5 59.96,30.22
N$25  (1 unrouted)
  Bottom 0.305: IC4A.12 54.14,43.4 arc-45 55.55,42.81 61.17,37.19 arc-45 61.76,35.78 61.76,32.01
N$26
  Top 0.305: J6.6 77.69,14.38 arc-45 77.98,13.68 77.98,12.53 arc45 78.28,11.82 80.52,9.58 arc-90 80.52,9.12 80.34,8.94 arc90 80.34,8.48 arc90 80.8,8.48 81.61,9.3 arc-90 82.08,9.3 arc-90 82.08,8.84 81.26,8.02 arc90 81.26,7.56 arc90 81.72,7.56 81.89,7.74 arc-90 82.35,7.74 arc-45 82.65,7.03 82.65,3.19
  Bottom 0.305: IC2.26 72.54,17.33 arc45 72.97,17.15 74.11,17.15 arc-90 74.39,16.88 74.39,16.43 arc180 74.94,16.43 74.94,16.82 arc-45 75.12,17.25 75.4,17.53 arc-180 75.79,17.14 75.55,16.91 arc90 75.55,16.52 J6.6
N$27  (1 unrouted)
  Bottom 0.305: 29.93,28.52 J12.5 26.26,24.85 arc-45 25.83,24.67 25.65,24.67 arc45 25.22,24.49 IC3.3
N$28  (1 unrouted)
  Bottom 0.305: 31.72,26.72 J12.4 29.28,24.28 arc-45 28.85,24.1 25.79,24.1 arc45 25.36,23.92 IC3.4
N$29  (1 unrouted)
  Bottom 0.305: 33.52,24.93 J12.3 28.92,22.67 arc-45 28.49,22.85 28.02,23.32 arc45 27.59,23.5 25.89,23.5 arc45 25.46,23.32 IC3.5
N$30  (1 unrouted)
  Bottom 0.305: 31.13,29.72 34.13,32.72 arc45 34.42,33.43 34.42,40.21 arc-45 34.71,40.91 35.17,41.37 arc-90 35.63,41.37 arc90 36.09,41.37 arc90 36.09,41.83 arc-90 36.09,42.29 36.12,42.32 arc-90 36.58,42.32 37.06,41.85 arc90 37.52,41.85 38.77,43.1 arc-45 39.48,43.4 IC4A.9
N$31  (1 unrouted)
  Bottom 0.305: 32.92,27.92 35.55,30.55 arc45 36.14,31.97 36.14,33.99 arc90 35.81,34.32 | 36,34.97 arc90 36.33,35.3 arc90 36,35.62 35.81,35.62 arc-90 35.49,35.95 arc-90 35.81,36.27 36,36.27 | 35.81,34.32 arc-90 35.49,34.65 arc-90 35.81,34.97 36,34.97 | 36,34.97 | 35.81,34.32 | 36,36.27 arc90 36.33,36.59 arc90 36,36.92 35.81,36.92 arc-90 35.49,37.24 | 36,36.27 | 35.49,37.24 | 35.49,37.24 arc-90 35.81,37.57 arc90 36.14,37.9 36.14,38.8 arc-90 38.14,40.8 IC4A.5
N$32  (1 unrouted)
  Bottom 0.305: 37.53,36.57 arc90 37.21,36.25 arc90 37.53,35.92 37.67,35.92 arc-90 38,35.6 arc-90 37.67,35.27 37.49,35.27 arc90 37.16,34.95 arc90 37.49,34.62 37.67,34.62 arc-90 38,34.3 | IC4A.2 38.86,38.84 arc90 37.86,37.84 37.86,36.9 arc-90 37.53,36.57 | 38,31.7 arc-90 37.67,31.37 37.53,31.37 arc90 37.21,31.05 37.21,29.45 arc-45 36.62,28.03 34.72,26.13 | 38,31.7 | 38,31.7 arc90 37.67,32.02 37.49,32.02 arc-90 37.16,32.35 arc-90 37.49,32.67 37.67,32.67 arc90 38,33 arc90 37.67,33.32 37.49,33.32 arc-90 37.16,33.65 arc-90 37.49,33.97 37.67,33.97 arc90 38,34.3 | 38,34.3 | 37.53,36.57
N$33
  Bottom 0.305: LDO1.4 77.29,54.57 R8A.2
N$35
  pour Bottom (no thermals): 29.1,45.35 29.1,41.94 arc90 29.42,41.62 30.2,41.62 arc90 30.52,41.94 30.52,45.35
N$36
  pour Bottom (no thermals): 24.2,46.09 19.28,46.09 arc90 18.96,45.76 18.96,44.9 arc90 19.28,44.58 24.2,44.58 arc90 24.52,44.9 arc-90 24.71,45.09 26.1,45.09 26.1,45.57 24.71,45.57 arc-90 24.52,45.76 arc90
N$37  (2 unrouted)
  Bottom 0.305: 62.4,20.39 arc45 61.97,20.57 57.39,20.57 arc-45 56.96,20.75 J8.7 54.58,23.13 56.14,24.7 LDO7.5 | IC2.1 62.4,20.39 | 62.4,20.39
N$39
  Bottom 0.305: LDO6.4 32.7,45.42 R8F.2
N$40
  pour Bottom (no thermals): 73.13,42.1 79.1,42.1 arc90 79.43,42.43 79.43,47.38 arc90 79.1,47.71 78.17,47.7 arc90 77.17,46.7 77.17,46.4 arc-90 76.17,45.4 73.8,45.4 arc90 72.8,44.4 72.8,42.43 arc90
  pour Bottom (no thermals): 85.76,54.65 85.76,48.66 arc-45 85.49,48 arc45 85.2,47.3 85.2,44.47 arc90 86.2,43.47 87.2,43.47 arc90 88.2,44.47 88.2,54.65
  pour Bottom (no thermals): 73.69,54.65 79.01,54.65 79.01,56.9 75.65,56.9 arc-90 75.32,57.23 75.32,60.98 arc90 75,61.31 74.01,61.31 arc90 73.69,60.98
  pour Bottom (no thermals): 77.17,46.83 85.76,46.83 85.76,48.47 78.17,48.47 arc90 77.17,47.47
  pour Bottom (no thermals): 79.01,54.65 88.2,54.65 88.2,55.9 arc90 87.2,56.9 79.01,56.9
N$42
  Bottom 1.016: 22.78,47.19 19.3,47.19 arc90 18.3,46.19 18.3,39.79 arc-52 17.92,39 17.28,38.5 arc52 16.9,37.71 16.9,32.26 C5B.1
  pour Bottom (no thermals): 26.1,46.24 26.1,47.51 arc90 25.77,47.83 19.28,47.83 arc90 18.96,47.51 18.96,46.56 arc90 19.28,46.24
  pour Bottom (no thermals): 13.58,25.15 14.98,26.55 arc-90 16.4,26.55 18.56,24.4 arc-45 18.65,24.18 18.65,24.14 arc45 18.74,23.93 20.28,22.39 arc-180 20.03,22.14 19.58,22.6 arc45 18.87,22.89 arc-45 18.37,23.1 17.4,24.06 arc90 16.54,24.06 15.61,23.13 14.75,23.13 13.58,24.29 arc-90
  pour Bottom (rank 2, no thermals): 16.66,32.27 arc90 16.08,32.84 13.83,32.84 arc90 11.83,30.84 11.83,24.09 14.2,21.72 16.87,24.39 13.76,27.49 arc-45 13.47,28.2 13.47,29.78 arc-45 13.76,30.49 14.67,31.4 arc-45 15.37,31.69 16.08,31.69 arc90
N$43
  pour Bottom (no thermals): 78.84,37.2 78.84,32.29 arc90 79.17,31.96 80.03,31.96 arc90 80.35,32.29 80.35,37.2 arc90 80.03,37.53 arc-90 79.84,37.72 79.84,39.1 79.36,39.1 79.36,37.72 arc-90 79.17,37.53 arc90
N$44
  Bottom 0.305: LDO3.4 79.5,45.71 R8C.2
N$48
  pour Bottom (no thermals): 12.57,48 12.57,47.22 arc90 12.89,46.89 15.97,46.89 arc90 16.3,47.22 16.3,48 arc90 15.97,48.32 12.89,48.32 arc90
N$49
  pour Bottom (no thermals): 11.83,41.99 11.83,37.08 arc90 12.15,36.75 13.01,36.75 arc90 13.34,37.08 13.34,41.99 arc90 13.01,42.32 arc-90 12.83,42.51 12.83,43.9 12.34,43.9 12.34,42.51 arc-90 12.15,42.32 arc90
N$50
  Bottom 0.305: LDO2.4 12.49,50.5 R8B.2
N$51
  pour Bottom (rank 2, no thermals): 5.03,46.89 12.17,46.89 arc90 12.49,47.22 12.49,52.38 10.39,52.38 arc90 10.07,52.06 10.07,48.86 arc-90 9.74,48.53 5.03,48.53 arc-90 4.7,48.86 4.7,49.97 arc90 4.38,50.29 0.33,50.29 arc90 0,49.97 0,42.52 arc90 0.33,42.19 4.38,42.19 arc90 4.7,42.52 4.7,46.57 arc-90
  pour Bottom (rank 2, no thermals): 29.1,43.5 34.38,43.5 arc90 34.7,43.82 34.7,47.82 arc90 34.38,48.15 31.06,48.15 arc-90 30.74,48.47 30.74,52.06 arc90 30.41,52.38 29.1,52.38
  pour Bottom (no thermals): 12.09,51.02 29.1,51.02 29.1,52.38 12.09,52.38
N$66  (2 unrouted)
  Bottom 0.305: 26.32,32.09 28.11,30.3 28.18,30.37 | 26.32,32.09 26.3,32.07 J12.7 23.95,29.73 arc45 23.77,29.3 23.77,24.71 arc-45 23.6,24.28 IC3.1 | LDO8.5 26.32,32.09
N$69
  pour Bottom (no thermals): 75.78,20.76 76.33,20.76 arc45 76.76,20.94 78.21,22.39 arc-90 79.07,22.39 79.9,21.56 arc-90 79.9,20.7 78.79,19.59 arc-45 78.36,19.41 75.31,19.41 arc-45 74.88,19.59 73.65,20.83 arc90 72.78,20.83 71.98,20.02 arc-180 71.73,20.27 72.73,21.27 arc-45 73.16,21.44 74.59,21.44 arc-45 75.02,21.27 75.35,20.94 arc45
  pour Bottom (no thermals): 81.56,21.53 83.03,21.53 arc90 83.67,22.17 arc90 83.03,22.8 79.21,22.8 arc45 78.21,22.39 79.9,20.7 80.14,20.94 arc-45
N$79
  Top 0.305: J10.1 2.46,11.82 arc45 2.16,11.12 2.16,3.19
  Bottom 0.305: IC3.36 17.18,17.87 arc-90 16.32,17.87 arc45 15.96,18.02 15.03,18.02 arc-45 14.6,18.2 13.9,18.9 arc45 13.47,19.08 J10.1
N$80
  Top 0.305: J9.1 19.26,3.48 arc-45 18.55,3.19 arc90 18.23,2.87 18.23,1.62 arc-90 17.9,1.3 arc-90 17.58,1.62 17.58,4.75 arc90 17.25,5.08 arc90 16.93,4.75 16.93,1.62 arc-90 16.6,1.3 arc-90 16.28,1.62 16.28,2.87 arc90 15.95,3.19 14.86,3.19
  Bottom 0.305: IC3.25 21.07,13.98 arc90 21.07,13.12 arc-45 21.22,12.76 21.22,11.83 arc45 21.4,11.4 22.1,10.69 arc-45 22.28,10.26 J9.1
N$81
  Bottom 0.305: IC3.10 27.02,21.34 arc-90 27.88,21.34 31.76,17.46 arc45 32.19,17.28 J9.7
N$82
  Top 0.305: J6.1 70.63,3.48 arc45 71.34,3.19 arc-90 71.66,2.87 71.66,1.62 arc90 71.99,1.3 arc90 72.31,1.62 72.31,4.75 arc-90 72.64,5.08 arc-90 72.96,4.75 72.96,1.62 arc90 73.29,1.3 arc90 73.61,1.62 73.61,2.87 arc-90 73.94,3.19 75.03,3.19
  Bottom 0.305: IC2.36 68.82,13.98 arc-90 68.82,13.12 arc45 68.67,12.76 68.67,11.83 arc-45 68.49,11.4 67.78,10.69 arc45 67.61,10.26 J6.1
N$83
  Top 0.305: J6.3 | J6.3 72.78,10.1 arc-45 73.49,9.8 75.77,7.53 arc-90 75.77,7.07 75.46,6.77 arc90 75.46,6.31 arc90 75.92,6.31 76.99,7.37 arc-90 77.45,7.37 arc-90 77.45,6.92 76.38,5.85 arc90 76.38,5.39 arc90 76.84,5.39 77.91,6.46 arc-90 78.37,6.46 arc-90 78.37,6 78.06,5.69 arc90 78.06,5.23 80.11,3.19
  Bottom 0.305: IC2.35 69.36,14.15 arc-45 69.53,13.72 69.53,12.57 arc90 69.81,12.29 70.26,12.29 arc-180 70.26,11.74 69.87,11.74 arc45 69.44,11.57 69.15,11.28 arc180 69.54,10.89 69.78,11.13 arc-90 70.17,11.13 J6.3
N$87
  Top 0.305: J10.3 12.2,14.38 arc45 11.91,13.68 11.91,12.53 arc-45 11.61,11.82 9.37,9.58 arc90 9.37,9.12 9.55,8.94 arc-90 9.55,8.48 arc-90 9.09,8.48 8.27,9.3 arc90 7.81,9.3 arc90 7.81,8.84 8.63,8.02 arc-90 8.63,7.56 arc-90 8.17,7.56 8,7.74 arc90 7.54,7.74 arc45 7.24,7.03 7.24,3.19
  Bottom 0.305: IC3.35 17.35,17.33 arc-45 16.92,17.15 15.78,17.15 arc90 15.5,16.88 15.5,16.43 arc-180 14.95,16.43 14.95,16.82 arc45 14.77,17.25 14.49,17.53 arc180 14.1,17.14 14.33,16.91 arc-90 14.33,16.52 J10.3
N$88
  Top 0.305: J10.6 17.1,10.1 arc45 16.4,9.8 14.12,7.53 arc90 14.12,7.07 14.43,6.77 arc-90 14.43,6.31 arc-90 13.97,6.31 12.9,7.37 arc90 12.44,7.37 arc90 12.44,6.92 13.51,5.85 arc-90 13.51,5.39 arc-90 13.05,5.39 11.98,6.46 arc90 11.52,6.46 arc90 11.52,6 11.82,5.69 arc-90 11.82,5.23 9.78,3.19
  Bottom 0.305: IC3.26 20.53,14.15 arc45 20.36,13.72 20.36,12.57 arc-90 20.08,12.29 19.63,12.29 arc180 19.63,11.74 20.02,11.74 arc-45 20.45,11.57 20.74,11.28 arc-180 20.35,10.89 20.11,11.13 arc90 19.72,11.13 J10.6
N$90
  Top 0.305: 87.43,11.82 arc-45 87.73,11.12 87.73,3.19 | J5.1 87.43,11.82 | 87.43,11.82
  Bottom 0.305: IC2.25 72.7,17.87 arc90 73.57,17.87 arc-45 73.93,18.02 74.86,18.02 arc45 75.29,18.2 75.99,18.9 arc-45 76.42,19.08 J5.1
N$96  (1 unrouted)
  Bottom 0.305: 58.17,11.43 J7.4 60.37,13.74 arc-45 60.08,14.45 60.08,15.81 arc-45 60.37,16.51 60.74,16.88 arc-90 61.8,16.88 61.94,16.75 arc90 62.8,16.75 IC2.46
N$101
  pour Bottom (no thermals): 23.96,10.9 23.96,10.36 arc45 24.14,9.92 25.59,8.48 arc-90 25.59,7.61 24.77,6.79 arc-90 23.9,6.79 22.8,7.9 arc-45 22.62,8.33 22.62,11.37 arc-45 22.8,11.8 24.03,13.04 arc90 24.03,13.9 23.22,14.71 arc-180 23.47,14.95 24.47,13.95 arc-45 24.65,13.52 24.65,12.09 arc-45 24.47,11.66 24.14,11.34 arc45
  pour Top (no thermals): 26.41,3.45 26.41,7.66 24.97,9.1 arc90 23.28,9.1 arc90 23.28,7.41 25.13,5.56 25.13,3.45 arc90 25.77,2.81 arc90
N$102
  pour Bottom (no thermals): 66.97,11.15 64.3,8.48 arc90 64.3,7.61 65.12,6.79 arc90 65.98,6.79 67.43,8.23 arc45 67.61,8.66 67.61,10.26 arc-45 67.78,10.69 68.49,11.4 arc45 68.67,11.83 68.67,13.41 arc45 68.49,13.85 67.33,15 arc90 66.47,15 65.65,14.19 arc90 65.65,13.33 66.97,12.01 arc-90
  pour Top (no thermals): 64.64,4.62 64.64,3.83 arc-90 64,3.19 arc-90 63.36,3.83 63.36,6.72 arc-45 63.95,8.13 64.91,9.09 arc-90 66.6,9.09 arc-90 66.6,7.4 65.23,6.03 arc45
N$105  (via drill 0.3)
  other vias: 67.61,24.67
  pour Bottom (no thermals): 69.26,25.08 67.68,23.51 arc-90 66.82,23.51 65.85,24.47 67.4,26.02 arc-45 67.84,26.2 68.74,26.2 arc-45 69.18,26.02 69.26,25.94 arc-90
N$106  (via drill 0.3)
  Bottom 0.305: IC2.7 64.42,22.61 arc45 63.99,22.79 SMUTE1.1
  other vias: 63.89,22.79
N$107  (via drill 0.3)
  other vias: 27.88,19.08
  pour Bottom (no thermals): 28.28,17.43 26.71,19 arc-90 26.71,19.86 27.68,20.83 29.23,19.28 arc-45 29.41,18.85 29.41,17.94 arc-45 29.23,17.51 29.15,17.43 arc-90
N$114  (via drill 0.3)
  Bottom 0.305: IC3.7 25.82,22.26 arc45 26,22.69 SMUTE2.1
  other vias: 26,22.79
N$116
  Bottom 0.305: IC3.11 27.19,20.81 arc-90 27.7,20.81 29.18,19.33 arc-45 29.36,18.9 29.36,17.64 arc45 29.54,17.21 J9.6
PDN  (via drill 0.35)  (2 unrouted)
  Top 0.305: v14.59,55.23 arc45 14.11,55.43 8.49,55.43 arc-90 6.49,57.43 J3.1 | v63.8,30.7 59.21,26.11 arc45 58.63,24.7 J8.6
  Bottom 0.305: IC2.2 61.84,21.66 arc45 61.41,21.84 59.71,21.84 arc-45 59.27,22.02 J8.6 | IC3.2 24.87,24.85 arc45 25.05,25.28 25.05,26.98 arc-45 25.23,27.41 J12.6 27.44,28.06 arc45 28.15,28.35 32.81,33.01 arc45 33.4,34.43 33.4,40.07 arc-45 33.99,41.48 36.12,43.62 arc-45 36.83,43.91 37.02,43.91 arc45 37.73,44.2 38.62,45.1 | 38.62,45.1 53.88,45.1 arc-45 55.3,44.51 63.21,36.6 arc-45 63.8,35.18 v63.8,30.7 | 38.62,45.1 38.62,54.03 arc90 37.62,55.03 15.07,55.03 arc-45 v14.59,55.23 | 6.49,57.52 J3.1 3.19,60.81
SCL0  (via drill 0.35)  (1 unrouted)
  Top 0.305: v16.72,56.05 arc45 16.24,56.25 11.03,56.25 arc-90 9.03,58.25 J3.2 | v46.44,24.33 40.65,24.33 arc45 33.58,21.4 J12.2 | v49.7,27.59 49.7,27.62 50.68,26.64 arc90 57.74,26.64 62.92,31.82 arc-90 65.44,31.82 arc-45 65.81,30.93 J8.2
  Bottom 0.305: J12.2 30.01,20.87 arc-45 29.58,21.05 27.88,22.75 arc90 27.02,22.75 IC3.8 | IC2.8 63.93,23.81 arc-90 63.93,24.67 65.63,26.37 arc45 65.81,26.8 J8.2 65.81,34.57 arc45 65.22,35.98 55.88,45.33 arc45 54.47,45.92 40.44,45.92 arc-90 39.44,46.92 39.44,54.85 arc90 38.44,55.85 17.21,55.85 arc-45 v16.72,56.05 | v49.7,27.59 arc-45 49.41,26.88 47.15,24.62 arc-45 v46.44,24.33 | 9.03,57.52 J3.2
SDA0  (via drill 0.35)  (1 unrouted)
  Top 0.305: v50.46,28.31 51.24,27.52 arc90 55.79,27.52 61.69,33.43 arc-90 65.83,33.43 J8.1 | J12.1 arc-45 41.4,21.79 v46.37,21.79 | v18.86,56.87 arc45 18.37,57.07 13.57,57.07 arc-90 11.57,59.07 J3.3
  Bottom 0.305: IC2.9 64.64,23.81 arc-90 64.64,24.67 67.43,27.46 arc45 67.61,27.89 J8.1 67.61,33.35 arc45 66.44,36.17 56.46,46.15 arc45 55.05,46.74 41.26,46.74 arc-90 40.26,47.74 40.26,55.67 arc90 39.26,56.67 19.34,56.67 arc-45 v18.86,56.87 | IC3.9 27.02,22.05 arc-90 27.88,22.05 30.67,19.26 arc45 31.1,19.08 J12.1 | v50.46,28.31 arc-90 50.46,26.76 48.95,25.25 arc45 48.37,23.84 48.37,23.79 arc-90 v46.37,21.79 | 11.57,57.52 J3.3

## Text on the board
tNames: SLOW | VCML VREFHL AVDD MCLK DGND +3.3V | SD LRCK DATA BICK PDN DVDD | SD LRCK DATA BICK PDN DVDD | VCMR DGND VREFHR +3.3V DIF1 DIF0 | AOLP | SLOW | AORP | DGND AORN VDDR VDDL AOLN DGND | VCMR DGND VREFHR +3.3V DIF1 DIF0 | VCML VREFHL AVDD MCLK DGND +3.3V | DGND AORN VDDR VDDL AOLN DGND | AORP | AOLP
tDocu: RIGHT | LEFT | AOLP DGND AOLN AORN DGND AORP | AOLP DGND AOLN AORN DGND AORP